# EAGLE design chassis (EAGLE 9.6.2)
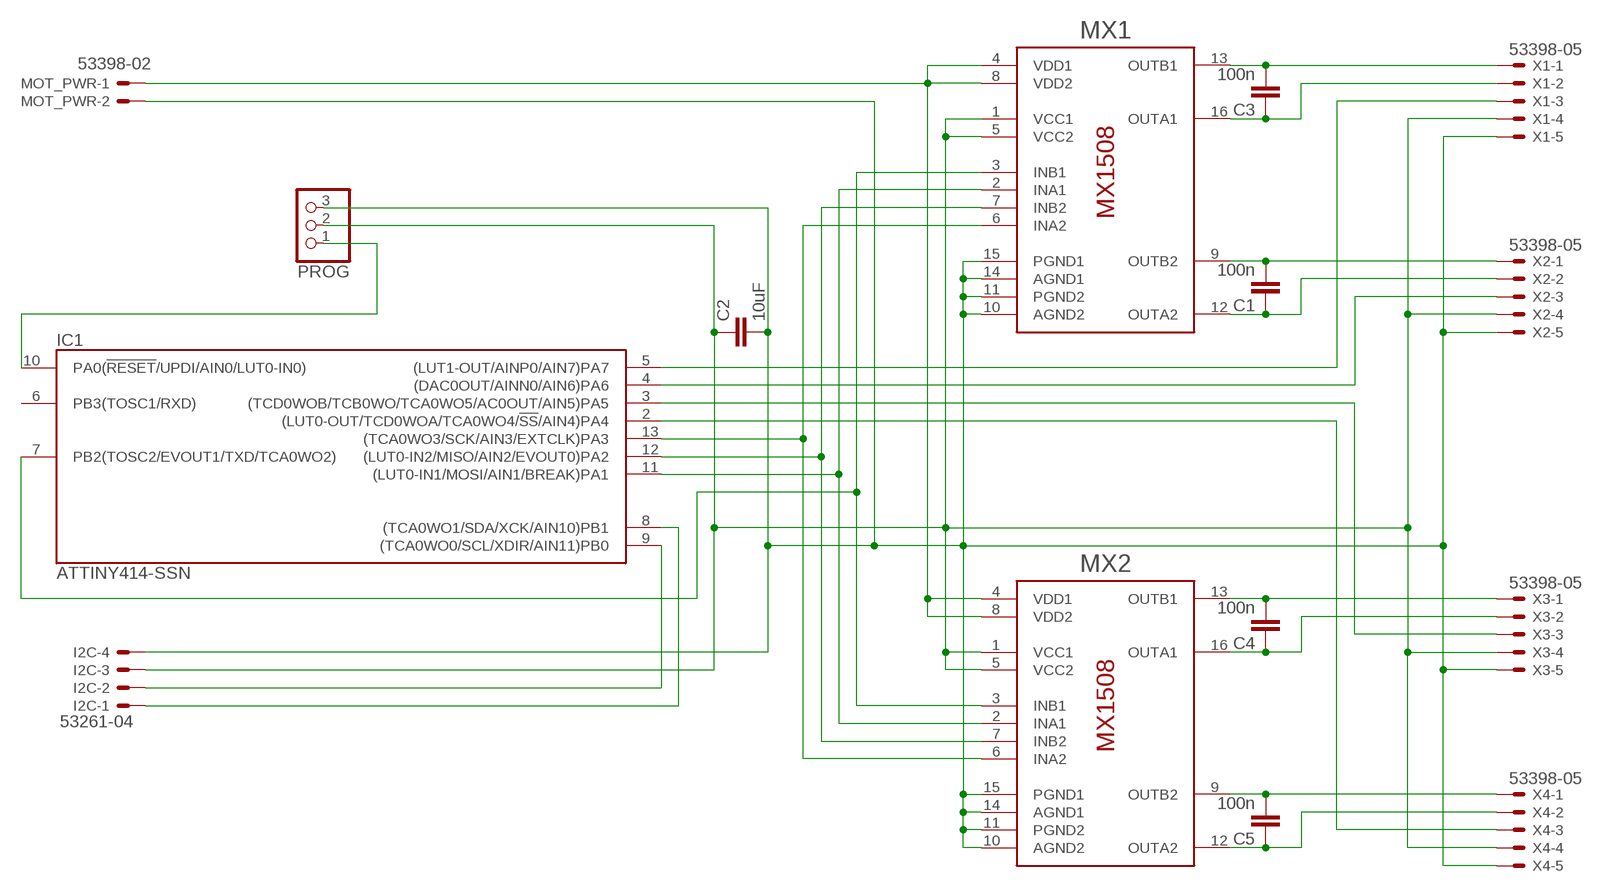
[diagram p0: schematic, sheet 1]

## Parts
C1  100n  C-EUC0805K  [C0805K]
C2  10uF  C-EUC0805K  [C0805K]
C3  100n  C-EUC0805K  [C0805K]
C4  100n  C-EUC0805K  [C0805K]
C5  100n  C-EUC0805K  [C0805K]
I2C  53261-04  [53261-04]
IC1  ATTINY414-SSN  [SO14]
MOT_PWR  53398-02  [53398-02]
MX1  MX1508  [SOP16]
MX2  MX1508  [SOP16]
PROG  PINHD-1X3/90  [1X03/90]
X1  53398-05  [53398-05]
X2  53398-05  [53398-05]
X3  53398-05  [53398-05]
X4  53398-05  [53398-05]

## Nets
GND: C2.2 I2C.4 MOT_PWR.2 MX1.10(AGND2) MX1.11(PGND2) MX1.14(AGND1) MX1.15(PGND1) MX2.10(AGND2) MX2.11(PGND2) MX2.14(AGND1) MX2.15(PGND1) PROG.3 X1.5 X2.5 X3.5 X4.5
N$1: C3.2 MX1.13(OUTB1) X1.1
N$2: C3.1 MX1.16(OUTA1) X1.2
N$3: C1.2 MX1.9(OUTB2) X2.1
N$4: C1.1 MX1.12(OUTA2) X2.2
N$5: C4.2 MX2.13(OUTB1) X3.1
N$6: C4.1 MX2.16(OUTA1) X3.2
N$7: C5.2 MX2.9(OUTB2) X4.1
N$8: C5.1 MX2.12(OUTA2) X4.2
N$9: IC1.5((LUT1-OUT/AINP0/AIN7)PA7) X1.3
N$10: IC1.4((DAC0OUT/AINN0/AIN6)PA6) X2.3
N$11: IC1.2((LUT0-OUT/TCD0WOA/TCA0WO4/!SS!/AIN4)PA4) X4.3
N$12: IC1.3((TCD0WOB/TCB0WO/TCA0WO5/AC0OUT/AIN5)PA5) X3.3
N$13: IC1.7(PB2(TOSC2/EVOUT1/TXD/TCA0WO2)) MX1.3(INB1) MX2.3(INB1)
N$14: IC1.11((LUT0-IN1/MOSI/AIN1/BREAK)PA1) MX1.2(INA1) MX2.2(INA1)
N$17: IC1.12((LUT0-IN2/MISO/AIN2/EVOUT0)PA2) MX1.7(INB2) MX2.7(INB2)
N$18: IC1.13((TCA0WO3/SCK/AIN3/EXTCLK)PA3) MX1.6(INA2) MX2.6(INA2)
N$19: I2C.2 IC1.9((TCA0WO0/SCL/XDIR/AIN11)PB0)
N$20: I2C.1 IC1.8((TCA0WO1/SDA/XCK/AIN10)PB1)
N$21: IC1.10(PA0(!RESET!/UPDI/AIN0/LUT0-IN0)) PROG.1
VCC: C2.1 I2C.3 MX1.1(VCC1) MX1.5(VCC2) MX2.1(VCC1) MX2.5(VCC2) PROG.2 X1.4 X2.4 X3.4 X4.4
VDD: MOT_PWR.1 MX1.4(VDD1) MX1.8(VDD2) MX2.4(VDD1) MX2.8(VDD2)
Unconnected: IC1.6(PB3(TOSC1/RXD))

## Power pins joined to a net without a drawn wire
GND: IC1.14(GND)
VCC: IC1.1(VCC)

## Library data of the parts
C1-C5 = rcl:C-EU: CAPACITOR, European symbol; SPICEPREFIX: C
I2C = con-molex:53?-04: CONNECTOR wire to board 1.25 mm (.049 inch) pitch header; MF: MOLEX; OC_FARNELL: 1125374; OC_NEWARK: unknown
IC1 = atmel:ATTINY*14: 8-bit AVR tiny-1-series Microcontroller CPU: two-cycle hardware multiplier single pin Unified Program Debug Interface (UPDI) programmable watchdog timer with separate on-chip oscillator programmable brown-out detection circuit with software disable function internal calibrated oscillator Status aktiv aktiv aktiv aktiv ATtiny214 ATtiny414 ATtiny814 ATtiny1614 General purpose working registers 32 SRAM 128 B 256 B 512 B 2 kB Program flash memory 2 kB 4 kB 8 kB 16 kB EEPROM 64 B 128 B 128 B 256 B 16-bit Timer/Counter type A (TCA) 1 16-bit Timer/Counter type B (TCB) 1 2 12-bit Timer/Counter type D (TCD) 1 Real Time Counter (RTC) 1 USART 1 SPI 1 TWI (I2C) 1 ADC 1 2 ADC channels 10 10+4 ADC resolution 10 bit DAC 1 3 AC 1 3 Peripheral Touch Controller (PTC) - 1 PTC number of self-capacitance channels - 6 PTC number of mutual-capacitance channels - 9 Custom Configurable Logic/Lookup tables 1/2 Window Watchdog 1 Event System channels 6 General purpose I/O 12 External interrupts 12 CRCSCAN 1 Operating voltage 1.8 ... 5.5 V Speed grade 0 ... 5 MHz @ 1.8 ... 5.5 V 0 ... 10 MHz @ 2.7 ... 5.5 V 0 ... 20 MHz @ 4.5 ... 5.5 V Clock options internal 16/20 MHz low power RC oscillator internal 32.768 kHz ultra low power RC oscillator external 32.768 kHz low-frequency crystal oscillator external clock input Pin Name Other/Special ADC0 ADC1 PTC AC0 AC1 AC2 DAC0 USART0 SPI0 TWI0 TCA0 TCBn TCD0 CCL PA0 !RESET, UPDI AIN0 LUT0-IN0 PA1 AIN1 TxD MOSI SDA LUT0-IN1 PA2 EVOUT0 AIN2 RxD MISO SCL LUT0-IN2 PA3 EXTCLK AIN3 XCK SCK WO3 TCB1 WO PA4 AIN4 AIN0 X0/Y0 XDIR !SS WO4 WOA LUT0-OUT PA5 VREFA AIN5 AIN1 X1/Y1 OUT AINN0 WO5 TCB0 WO WOB PA6 AIN6 AIN2 X2/Y2 AINN0 AINP1 AINP0 OUT PA7 AIN7 AIN3 X3/Y3 AINP0 AINP0 AINN0 LUT1-OUT PB3 TOSC1 OUT RxD WO0 PB2 TOSC2, EVOUT1 OUT TxD WO2 PB1 AIN10 X4/Y4 AINP2 XCK SDA WO1 PB0 AIN11 X5/Y5 AINP2 AINP1 XDIR SCL WO0 only available in devices with 8/16KByte flash, X- or Y-line only available in device ATtiny1614
MOT_PWR = con-molex:53?-02: CONNECTOR wire to board 1.25 mm (.049 inch) pitch header; MF: MOLEX; OC_FARNELL: unknown; OC_NEWARK: unknown
MX1 MX2 = hugo:MX1508
PROG = pinhead2:PINHD-1X3: PIN HEADER
X1-X4 = con-molex:53?-05: CONNECTOR wire to board 1.25 mm (.049 inch) pitch header; MF: MOLEX; OC_FARNELL: 1125354; OC_NEWARK: unknown

## Module CON5
Ports: 

### Library data of the parts

## Board
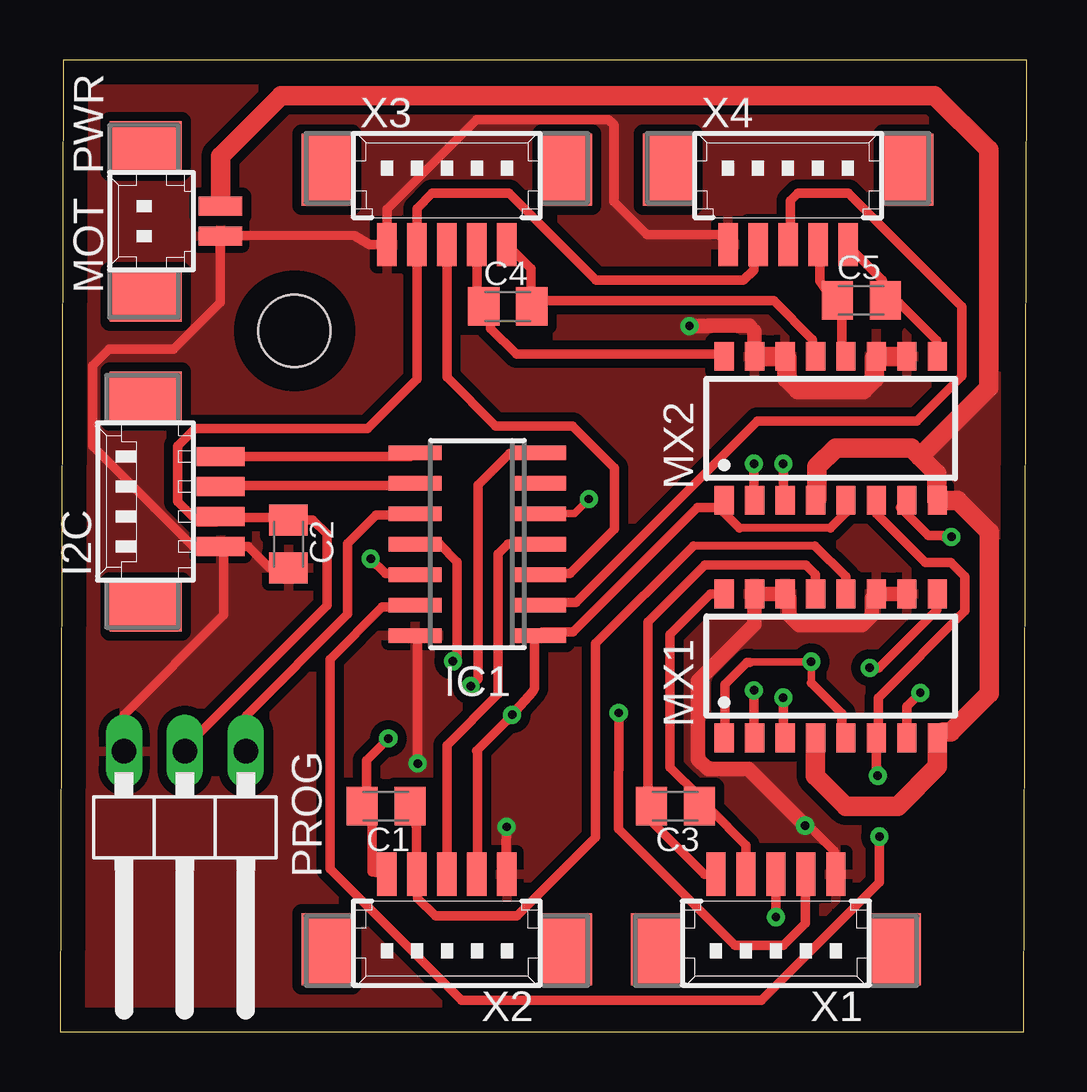
[diagram p1: board, top side]
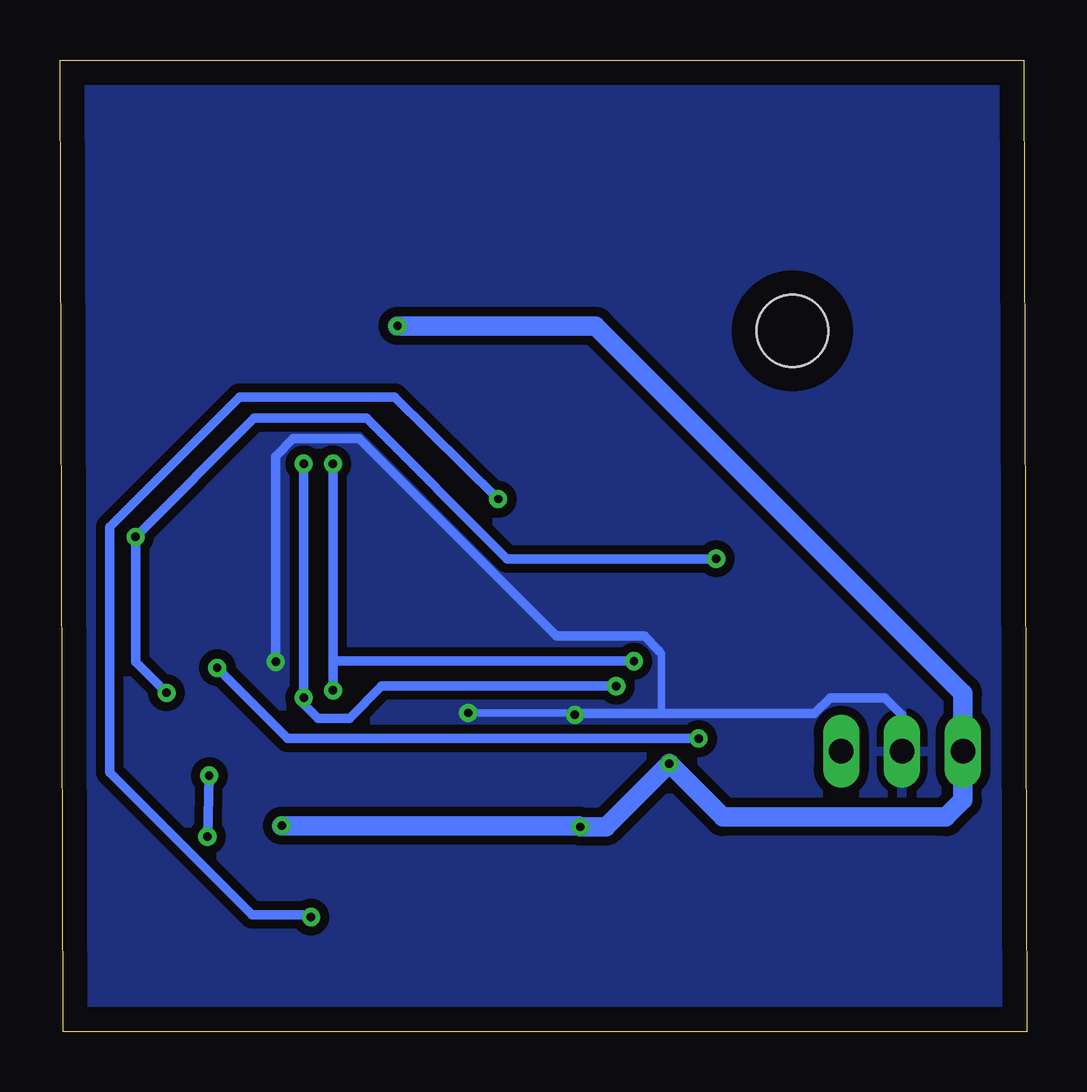
[diagram p2: board, bottom side, seen from below]

Size 40.31 x 40.5 mm. Coordinates in mm from the lower left corner, seen from the top.
Outline: 0,0 40.18,0 40.31,40.5 0.13,40.5 0,0
Copper layers (1*16): Top 0.035mm / dielectric 1.5mm / Bottom 0.035mm
Design rules "default *": minimum track width 12mil, minimum drill 0.35mm, track to track 15mil, track to pad 15mil, pad to pad 15mil, via to via 15mil, smd to smd 15mil, copper to edge 40mil, drill to drill 6mil, minimum pad ring 10mil, minimum via ring 8mil, stop-mask expansion 4mil, vias tented up to drill 0mil, thermal gap 12mil
Holes 3 mm at 9.78,29.21

### Footprints (pad centres in the part's own frame; a part is rotated, then mirrored left to right if it is on the bottom)
C0805K = smd 1.3 x 1.6: 1 -1,0; 2 1,0
53261-04 = smd 0.8 x 2: 1 1.875,-2.5; 2 0.625,-2.5; 3 -0.625,-2.5; 4 -1.875,-2.5 | smd 2.1 x 3: S1 4.375,0.625; S2 -4.375,0.625
SO14 = smd 0.6 x 2.2: 1 -3.81,-2.6; 2 -2.54,-2.6; 3 -1.27,-2.6; 4 0,-2.6; 5 1.27,-2.6; 6 2.54,-2.6; 7 3.81,-2.6; 8 3.81,2.6; 9 2.54,2.6; 10 1.27,2.6; 11 0,2.6; 12 -1.27,2.6; 13 -2.54,2.6; 14 -3.81,2.6
53398-02 = smd 0.8 x 1.8: 1 0.625,-2.5; 2 -0.625,-2.5 | smd 2.1 x 3: S1 3.125,0.625; S2 -3.125,0.625
SOP16 = smd 0.8 x 1.2: 1 -4.445,-3; 2 -3.175,-3; 3 -1.905,-3; 4 -0.635,-3; 5 0.635,-3; 6 1.905,-3; 7 3.175,-3; 8 4.445,-3; 9 4.445,3; 10 3.175,3; 11 1.905,3; 12 0.635,3; 13 -0.635,3; 14 -1.905,3; 15 -3.175,3; 16 -4.445,3
1X03/90 = drill 1.016 long: 1 -2.54,-3.81; 2 0,-3.81; 3 2.54,-3.81
53398-05 = smd 0.8 x 1.8: 1 2.5,-2.5; 2 1.25,-2.5; 3 0,-2.5; 4 -1.25,-2.5; 5 -2.5,-2.5 | smd 2.1 x 3: S1 5,0.625; S2 -5,0.625

### Placement (x,y rotation side)
C1  13.59,9.4 180 top
C2  9.52,20.32 270 top
C3  25.65,9.4 180 top
C4  18.67,30.23 0 top
C5  33.4,30.48 0 top
I2C  4.19,22.1 90 top
IC1  17.4,20.32 90 top
MOT_PWR  4.19,33.78 90 top
MX1  32.13,15.24 0 top
MX2  32.13,25.15 0 top
PROG  5.21,7.87 180 top
X1  29.85,4.06 180 top
X2  16.13,4.06 180 top
X3  16.13,35.31 0 top
X4  30.35,35.31 0 top

### Tracks (layer width: path | path; a pad name or v marks a point on that pad's centre or on a via)
GND  (via drill 0.35)
  Top 0.305: 30.1,18.24 30.15,18.19
  Top 0.38: 12.27,33.17 6.71,33.17
  Top 0.39: 6.71,33.17 MOT_PWR.2 6.68,33.12 6.68,30.38 4.75,28.45 2.06,28.45 1.37,27.76 1.37,24.41 5.77,20.02 6.64,20.02 6.67,20.14 | 12.27,33.17 12.9,32.81 X3.5 13.63,34.28 17.37,38.02 22.86,38.02 23.09,37.79 23.09,34.59 24.46,33.22 27.49,33.22 X4.5 | 34.11,18.19 MX1.11 | X1.5 32.28,6.6 32.28,7.52 31.22,8.58 v31.06,8.58 | v18.62,8.53 18.57,6.6 X2.5 | v14.91,11.18 14.91,16.36 IC1.14 | 6.67,20.14 I2C.4 7.84,20.22 8.75,19.32 C2.2 | 6.67,20.14 6.83,19.98 6.83,17.37 2.67,13.21 PROG.3
  Top 0.61: v31.06,8.58 28.7,10.95 27,10.95 26.6,11.36 26.6,14.61 28.96,16.97 MX1.15 MX1.14 30.41,18.06 30.41,17.36 30.81,16.95 33.45,16.95 33.85,17.36 33.85,18.06 MX1.11 MX1.10 | v26.24,29.41 26.98,29.41 27,29.43 28.73,29.43 28.96,29.21 MX2.15
  Top 0.813: MX2.15 MX2.14 30.31,28.06 30.31,27.22 30.77,26.76 33.49,26.76 33.95,27.22 33.95,28.06 MX2.11 MX2.10
  Bottom 0.39: v18.62,8.53 18.67,8.58
  Bottom 0.813: v18.62,8.53 17.55,8.53 v14.91,11.18 12.67,8.94 3.38,8.94 2.67,9.65 PROG.3 2.67,14.1 17.98,29.41 v26.24,29.41 | 18.67,8.58 v31.06,8.58
  pour Top: 0.25,0.25 40,0.25 40,40.64 0.25,40.64
N$1
  Top 0.39: X1.1 26.86,6.56 24.3,9.13 C3.2 24.51,9.54 24.51,17.07 26.89,19.45 31.1,19.45 31.5,19.05 MX1.13
N$2
  Top 0.39: X1.2 28.6,7.77 27.09,9.28 C3.1 26.65,9.79 25.43,11.02 25.43,16.56 27.11,18.24 MX1.16
N$3  (via drill 0.35)
  Top 0.39: v33.76,15.16 34.14,15.16 36.55,17.58 36.55,18.19 MX1.9 | v13.69,12.22 12.78,11.3 12.78,9.65 C1.2 12.78,9.35 13,9.12 13,6.67 X2.1
  Bottom 0.39: v33.76,15.16 30.81,12.22 v13.69,12.22
N$4
  Top 0.33: 31.48,20.25 26.4,20.25
  Top 0.39: C1.1 14.86,8.54 14.86,6.57 X2.2 14.91,6.3 14.91,5.56 15.65,4.83 19.05,4.83 22.33,8.1 22.33,16.18 26.4,20.25 | MX1.12 32.77,18.96 31.48,20.25
N$5
  Top 0.39: MX2.13 31.37,28.25 31.37,28.85 29.75,30.47 19.91,30.47 C4.2 | 20.14,30.43 C4.2 | X3.1 19.63,31.8 19.63,30.25 C4.2
N$6
  Top 0.39: MX2.16 27.41,28.25 19.03,28.25 17.96,29.31 17.96,30.18 C4.1 17.38,30.52 X3.2
N$7
  Top 0.39: MX2.9 36.55,28.25 36.55,28.8 34.98,30.37 C5.2 34.29,31.32 32.87,32.73 X4.1
N$8
  Top 0.39: MX2.12 32.59,28.25 32.59,30.41 C5.1 32.14,30.59 31.67,31.29 31.67,32.66 X4.2
N$9  (via drill 0.35)
  Top 0.305: IC1.5 21.44,21.59 v22.05,22.2
  Top 0.39: v29.85,4.78 X1.3
  Bottom 0.39: v29.85,4.78 29.95,4.88 32.31,4.88 38.23,10.79 38.23,21.03 32.82,26.44 26.37,26.44 v22.05,22.2
N$10
  Top 0.39: X2.3 16.13,11.94 18.26,14.07 18.26,19.91 18.67,20.32 IC1.4
N$11
  Top 0.39: X4.3 30.46,32.97 30.46,34.65 30.76,34.95 32.87,34.95 37.59,30.23 37.59,27.33 35.71,25.45 29.08,25.45 21.51,17.88 20.09,17.88 IC1.2
N$12
  Top 0.39: X3.3 16.13,27.28 18.16,25.25 21.36,25.25 23.11,23.5 23.11,20.96 21.26,19.1 20.09,19.1 IC1.3
N$13  (via drill 0.35)
  Top 0.39: v30.15,13.92 30.15,12.39 MX1.3 | v30.15,23.67 30.15,22.15 MX2.3 | v17.12,14.4 17.42,14.71 17.42,22.78 18.75,24.11 19.96,24.11 IC1.7
  Bottom 0.39: v30.15,23.67 v30.15,13.92 30.15,13.66 29.54,13.06 28.25,13.06 26.9,14.4 v17.12,14.4
N$14  (via drill 0.35)
  Top 0.39: v28.93,14.22 28.93,12.39 MX1.2 | v28.93,23.67 28.93,22.15 MX2.2 | IC1.11 15.82,20.32 16.56,19.58 16.56,15.62 v16.38,15.44
  Bottom 0.39: v28.93,23.67 28.93,15.44 | 28.93,15.44 v28.93,14.22 | 28.93,15.44 v16.38,15.44
N$17  (via drill 0.35)
  Top 0.39: v37.16,20.62 36.85,20.62 36.8,20.68 36.2,20.68 35.03,21.84 MX2.7 | v12.95,19.71 13.56,19.1 14.6,19.1 IC1.12 | v35.86,14.12 35.31,13.56 MX1.7
  Bottom 0.39: v12.95,19.71 21.67,19.71 27.53,25.58 32.21,25.58 v37.16,20.62 37.16,15.42 v35.86,14.12
N$18  (via drill 0.35)
  Top 0.39: IC1.13 14.73,17.7 13.44,17.7 11.25,15.52 11.25,6.78 16.74,1.29 29.23,1.29 34.16,6.22 v34.16,8.13 | v34.09,10.67 34.16,10.67 34.04,11.05 MX1.6 34.11,12.39 34.11,13.92 37.72,17.53 37.72,18.97 37.13,19.56 36.08,19.56 34.04,21.6 MX2.6
  Bottom 0.39: v34.09,10.67 v34.16,8.13
N$19
  Top 0.39: I2C.2 6.73,22.76 14.6,22.76 IC1.9
N$20
  Top 0.39: I2C.1 14.6,23.98 IC1.8
N$21
  Top 0.39: IC1.10 14.6,21.54 13.18,21.54 11.99,20.35 11.99,17.4 7.77,13.18 7.77,11.7 PROG.1
VCC  (via drill 0.35)
  Top 0.305: v31.32,15.42 31.32,15.26 | v31.32,15.42 31.32,14.53 | 28.75,15.39 28.78,15.42 v31.32,15.42
  Top 0.33: 32.12,21 28.33,21
  Top 0.39: X2.4 17.4,6.57 17.4,11.61 17.36,11.7 18.62,12.95 v18.85,13.21 19.71,14.17 19.79,14.3 19.79,16.36 IC1.1 20.09,16.66 21.39,16.66 26.57,21.84 27.41,21.84 MX2.1 27.69,21.64 28.33,21 | X4.4 28.93,32.66 28.93,31.75 28.5,31.32 22.35,31.32 18.72,34.95 15.52,34.95 14.88,34.31 X3.4 14.88,27.2 12.83,25.15 5.64,25.15 4.9,24.41 4.9,22.1 5.77,21.23 6.52,21.23 I2C.3 6.73,21.44 9.41,21.44 C2.1 10.54,21.32 11.12,20.74 11.12,17.76 5.16,11.79 PROG.2 | 28.75,15.39 28.63,15.39 27.71,14.48 27.71,12.39 MX1.1 | 31.32,14.53 32.59,13.26 32.59,12.39 MX1.5 | v23.29,13.28 23.29,8.46 28.14,3.61 30.15,3.61 31.06,4.52 31.06,6.3 X1.4 | 32.71,22.09 MX2.5 32.77,21.64 32.12,21
  Bottom 0.305: 15.34,15.87 15.24,15.77 15.24,13.26 | v18.85,13.21 19.06,13.2 18.97,13.28 v23.29,13.28
  Bottom 0.39: v18.85,13.21 18.69,13.26 15.24,13.26 8.87,13.26 8.2,13.92 5.92,13.92 5.21,13.21 PROG.2 | v31.32,15.42 31.32,23.98 30.58,24.71 27.84,24.71 19.61,16.48 15.95,16.48 15.34,15.87
  pour Bottom: 0.51,40.39 39.75,40.39 39.75,0.51 0.51,0.51
VDD
  Top 0.813: MX1.4 31.5,10.67 32.77,9.4 34.92,9.4 36.58,11.05 MX1.8 36.83,12.49 37.13,12.49 38.73,14.1 38.73,20.83 37.42,22.15 MX2.8 36.55,22.15 36.55,23.27 35.84,23.98 | MX2.4 31.55,22.2 31.55,23.55 32.33,24.33 35.48,24.33 35.84,23.98 | MOT_PWR.1 6.69,36.48 9.22,39.01 36.45,39.01 38.71,36.75 38.71,26.85 35.84,23.98
  pour Top: 35.81,24.13 39.24,27.56 39.37,27.56 39.37,20.32 35.81,23.88